# Altium schematic sheet mainboard_motor.v1.0.SchDoc
size A4
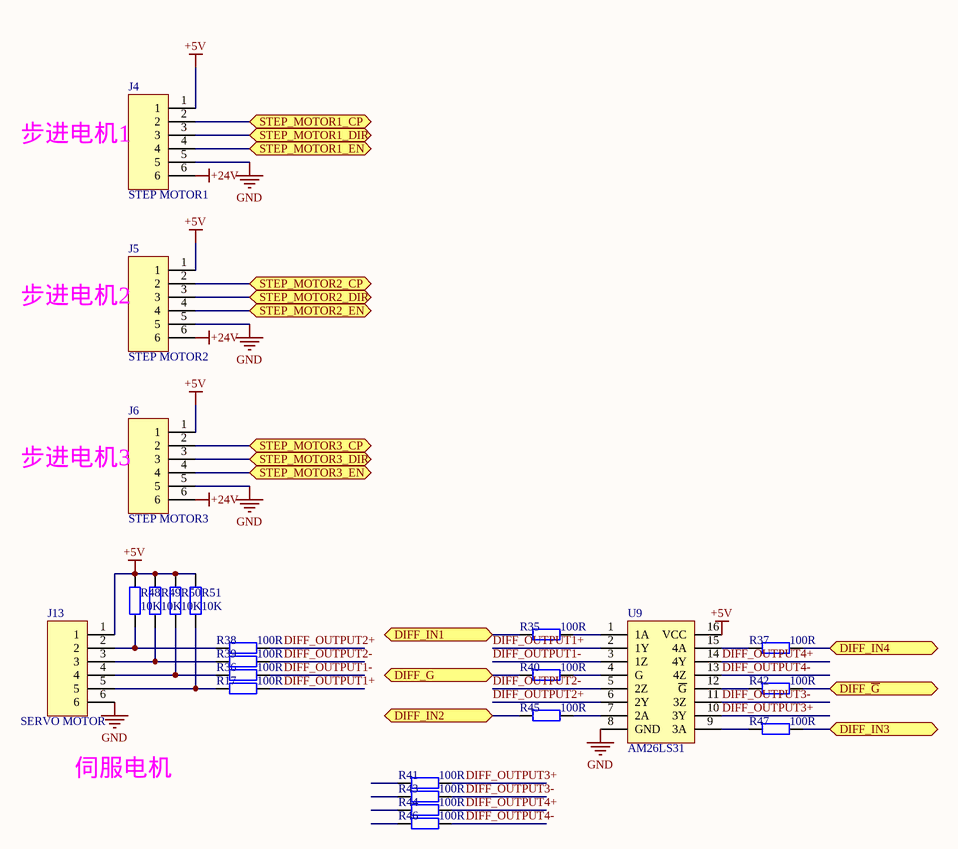
[diagram p0: mainboard_motor.v1.0.SchDoc]

## Parts
J4  STEP MOTOR1  [XH2.54-6T]
J5  STEP MOTOR2  [XH2.54-6T]
J6  STEP MOTOR3  [XH2.54-6T]
J13  SERVO MOTOR  [XH2.54-6T]
R17  100R  [0805]
R35  100R  [0805]
R36  100R  [0805]
R37  100R  [0805]
R38  100R  [0805]
R39  100R  [0805]
R40  100R  [0805]
R41  100R  [0805]
R42  100R  [0805]
R43  100R  [0805]
R44  100R  [0805]
R45  100R  [0805]
R46  100R  [0805]
R47  100R  [0805]
R48  10K  [0805]
R49  10K  [0805]
R50  10K  [0805]
R51  10K  [0805]
U9  AM26LS31  [SO-16]

## Ports
DIFF_G, DIFF_IN1, DIFF_IN2, DIFF_IN3, DIFF_IN4, DIFF_~{G}, STEP_MOTOR1_CP, STEP_MOTOR1_DIR, STEP_MOTOR1_EN, STEP_MOTOR2_CP, STEP_MOTOR2_DIR, STEP_MOTOR2_EN, STEP_MOTOR3_CP, STEP_MOTOR3_DIR, STEP_MOTOR3_EN

## Nets
+5V: J4.1 J5.1 J6.1 J13.1 R48.1 R49.1 R50.1 R51.1 U9.16(VCC)
+24V: J4.6 J5.6 J6.6
GND: J4.5 J5.5 J6.5 J13.6 U9.8(GND)
DIFF_G: R40.2 ; port DIFF_G
DIFF_~{G}: R42.1 ; port DIFF_~{G}
DIFF_IN1: R35.2 ; port DIFF_IN1
DIFF_IN2: R45.2 ; port DIFF_IN2
DIFF_IN3: R47.1 ; port DIFF_IN3
DIFF_IN4: R37.1 ; port DIFF_IN4
DIFF_OUTPUT1+: R17.1 U9.2(1Y)
DIFF_OUTPUT1-: R36.1 U9.3(1Z)
DIFF_OUTPUT2+: R38.1 U9.6(2Y)
DIFF_OUTPUT2-: R39.1 U9.5(2Z)
DIFF_OUTPUT3+: R41.1 U9.10(3Y)
DIFF_OUTPUT3-: R43.1 U9.11(3Z)
DIFF_OUTPUT4+: R44.1 U9.14(4Y)
DIFF_OUTPUT4-: R46.1 U9.13(4Z)
STEP_MOTOR1_CP: J4.2 ; port STEP_MOTOR1_CP
STEP_MOTOR1_DIR: J4.3 ; port STEP_MOTOR1_DIR
STEP_MOTOR1_EN: J4.4 ; port STEP_MOTOR1_EN
STEP_MOTOR2_CP: J5.2 ; port STEP_MOTOR2_CP
STEP_MOTOR2_DIR: J5.3 ; port STEP_MOTOR2_DIR
STEP_MOTOR2_EN: J5.4 ; port STEP_MOTOR2_EN
STEP_MOTOR3_CP: J6.2 ; port STEP_MOTOR3_CP
STEP_MOTOR3_DIR: J6.3 ; port STEP_MOTOR3_DIR
STEP_MOTOR3_EN: J6.4 ; port STEP_MOTOR3_EN
NetJ13_2: J13.2 R38.2 R48.2
NetJ13_3: J13.3 R39.2 R49.2
NetJ13_4: J13.4 R36.2 R50.2
NetJ13_5: J13.5 R17.2 R51.2
NetR35_1: R35.1 U9.1(1A)
NetR37_2: R37.2 U9.15(4A)
NetR40_1: R40.1 U9.4(G)
NetR42_2: R42.2 U9.12(~{G})
NetR45_1: R45.1 U9.7(2A)
NetR47_2: R47.2 U9.9(3A)

Not connected (* = marked no-connect by the designer): R41 2; R43 2; R44 2; R46 2

## Notes on the sheet
- 步进电机1
- 步进电机2
- 步进电机3
- 伺服电机

## Library data of the parts
J4-J6 J13 = SH-6
R17 R35-R51 = Res2: Resistor; Value: 1K; Published: 8-Jun-2000; LatestRevisionDate: 17-Jul-2002; LatestRevisionNote: Re-released for DXP Platform.; PackageReference: AXIAL-0.4; Publisher: Altium Limited